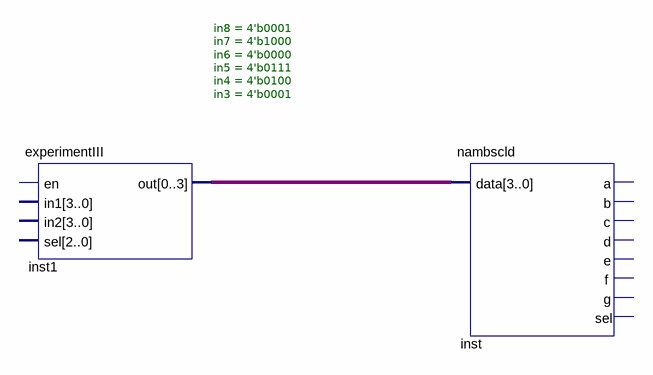
[diagram p0: schematic sheet]
// Quartus schematic a31.bdf as structural Verilog: 2 symbols, 0 pins
module a31 (
);

  wire [3:0] inst1_out;

  experimentIII #(.in8(4'b0001), .in7(4'b1000), .in6(4'b0000), .in5(4'b0111), .in4(4'b0100), .in3(4'b0001)) inst1 (.out(inst1_out));  // open: en, in1, in2, sel
  nambscld inst (.data(inst1_out));  // open: a, b, c, d, e, f, g, sel
endmodule
